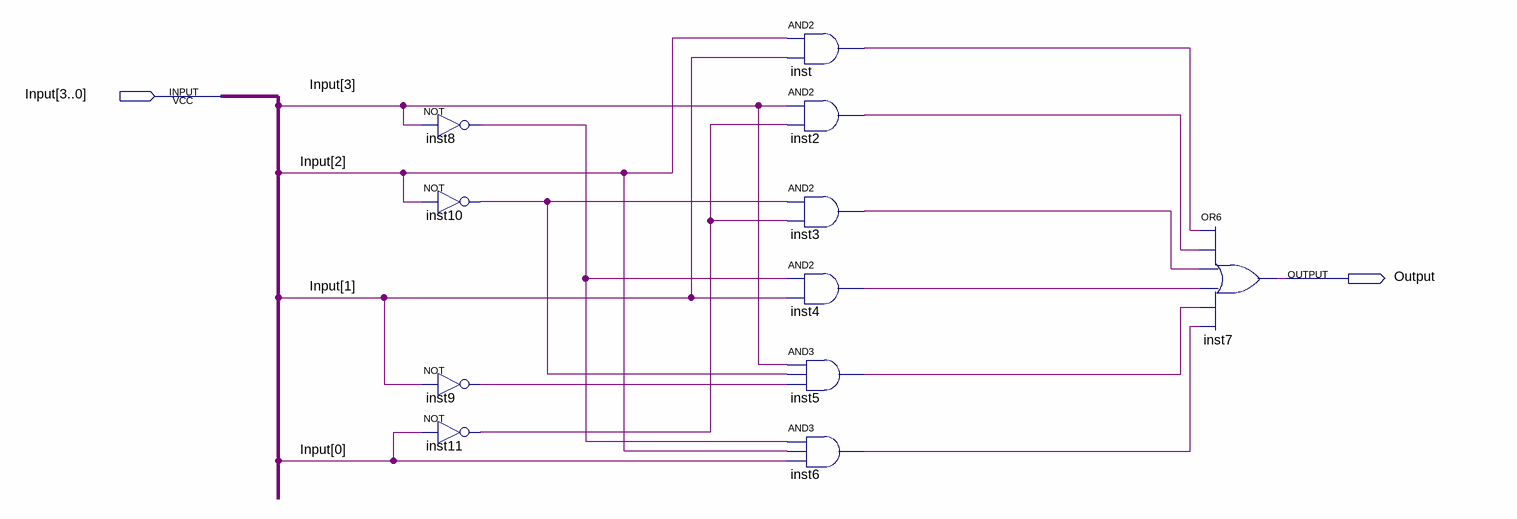
[diagram p0: schematic sheet]
// Quartus schematic display_a.bdf as structural Verilog: 11 symbols, 2 pins
module display_a (
  input  [3:0] Input,
  output Output
);

  wire inst2_out, inst3_out, inst4_out, inst5_out, inst6_out, inst8_out, inst9_out, inst10_out, inst11_out,
       inst_out;

  not inst8 (inst8_out, Input[3]);
  not inst10 (inst10_out, Input[2]);
  not inst9 (inst9_out, Input[1]);
  not inst11 (inst11_out, Input[0]);
  and inst (inst_out, Input[2], Input[1]);
  and inst2 (inst2_out, Input[3], inst11_out);
  and inst3 (inst3_out, inst10_out, inst11_out);
  and inst4 (inst4_out, inst8_out, Input[1]);
  and inst5 (inst5_out, Input[3], inst10_out, inst9_out);
  and inst6 (inst6_out, inst8_out, Input[2], Input[0]);
  or inst7 (Output, inst_out, inst2_out, inst3_out, inst4_out, inst5_out, inst6_out);
endmodule
